# EAGLE board cosmicpifpgaOHL (EAGLE 8.3.1), part 1 of 2
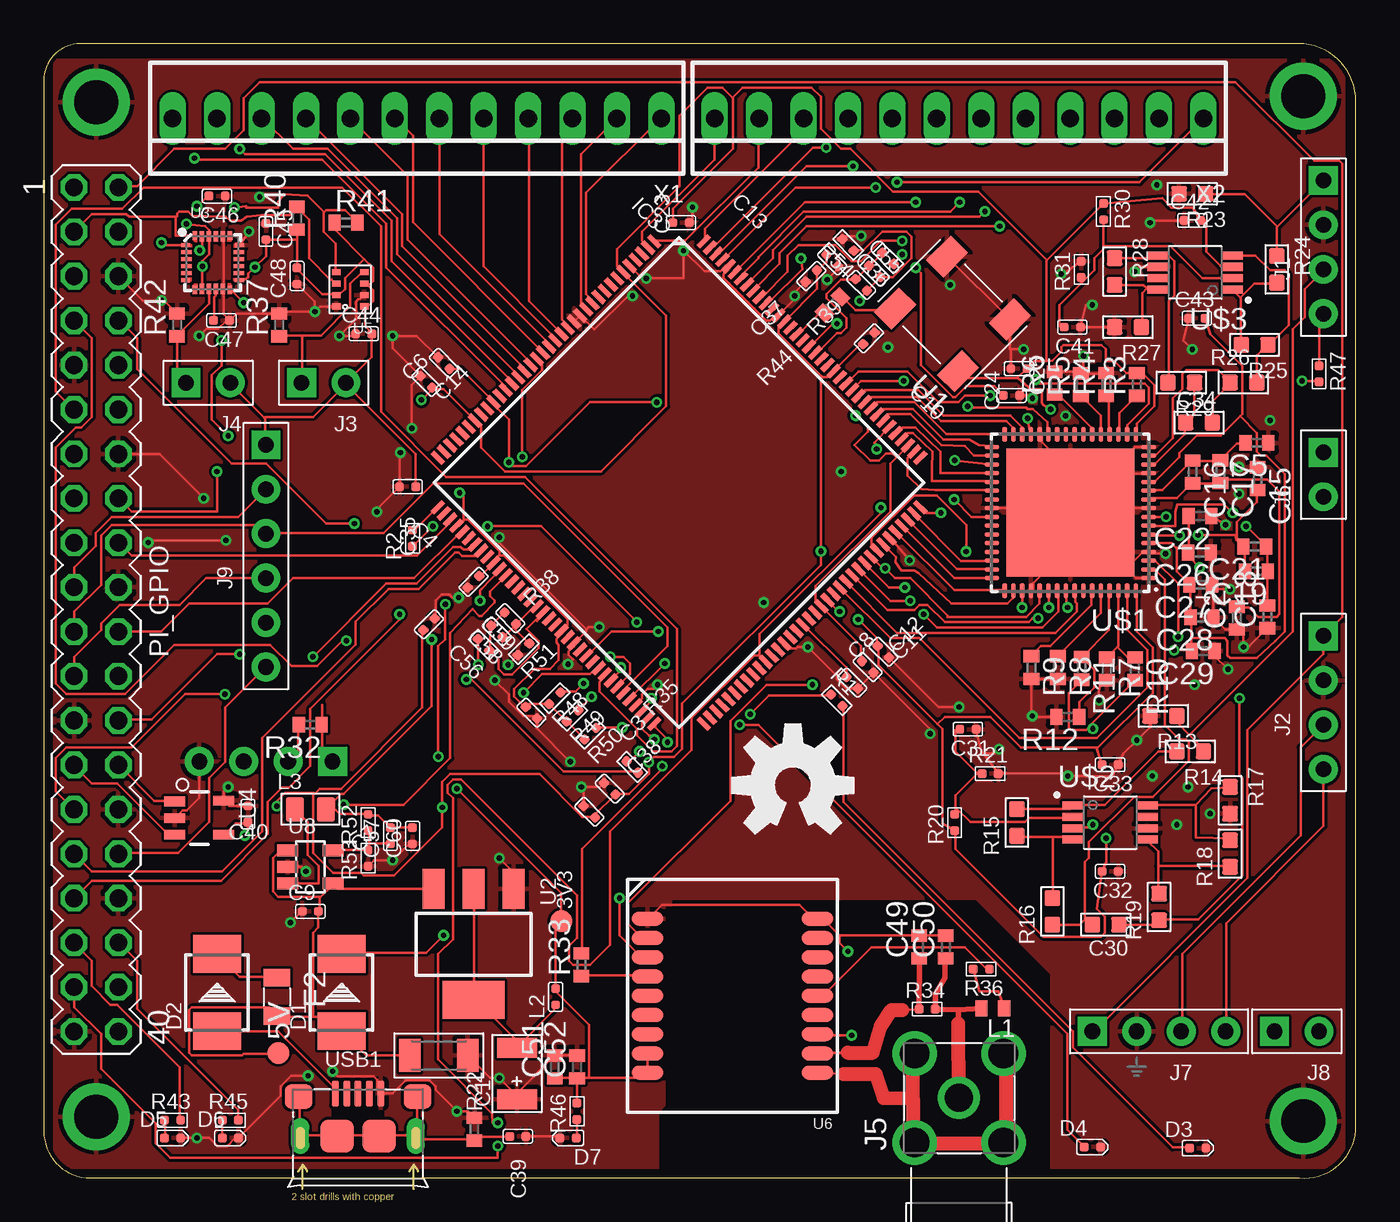
[diagram p2: board, top side]
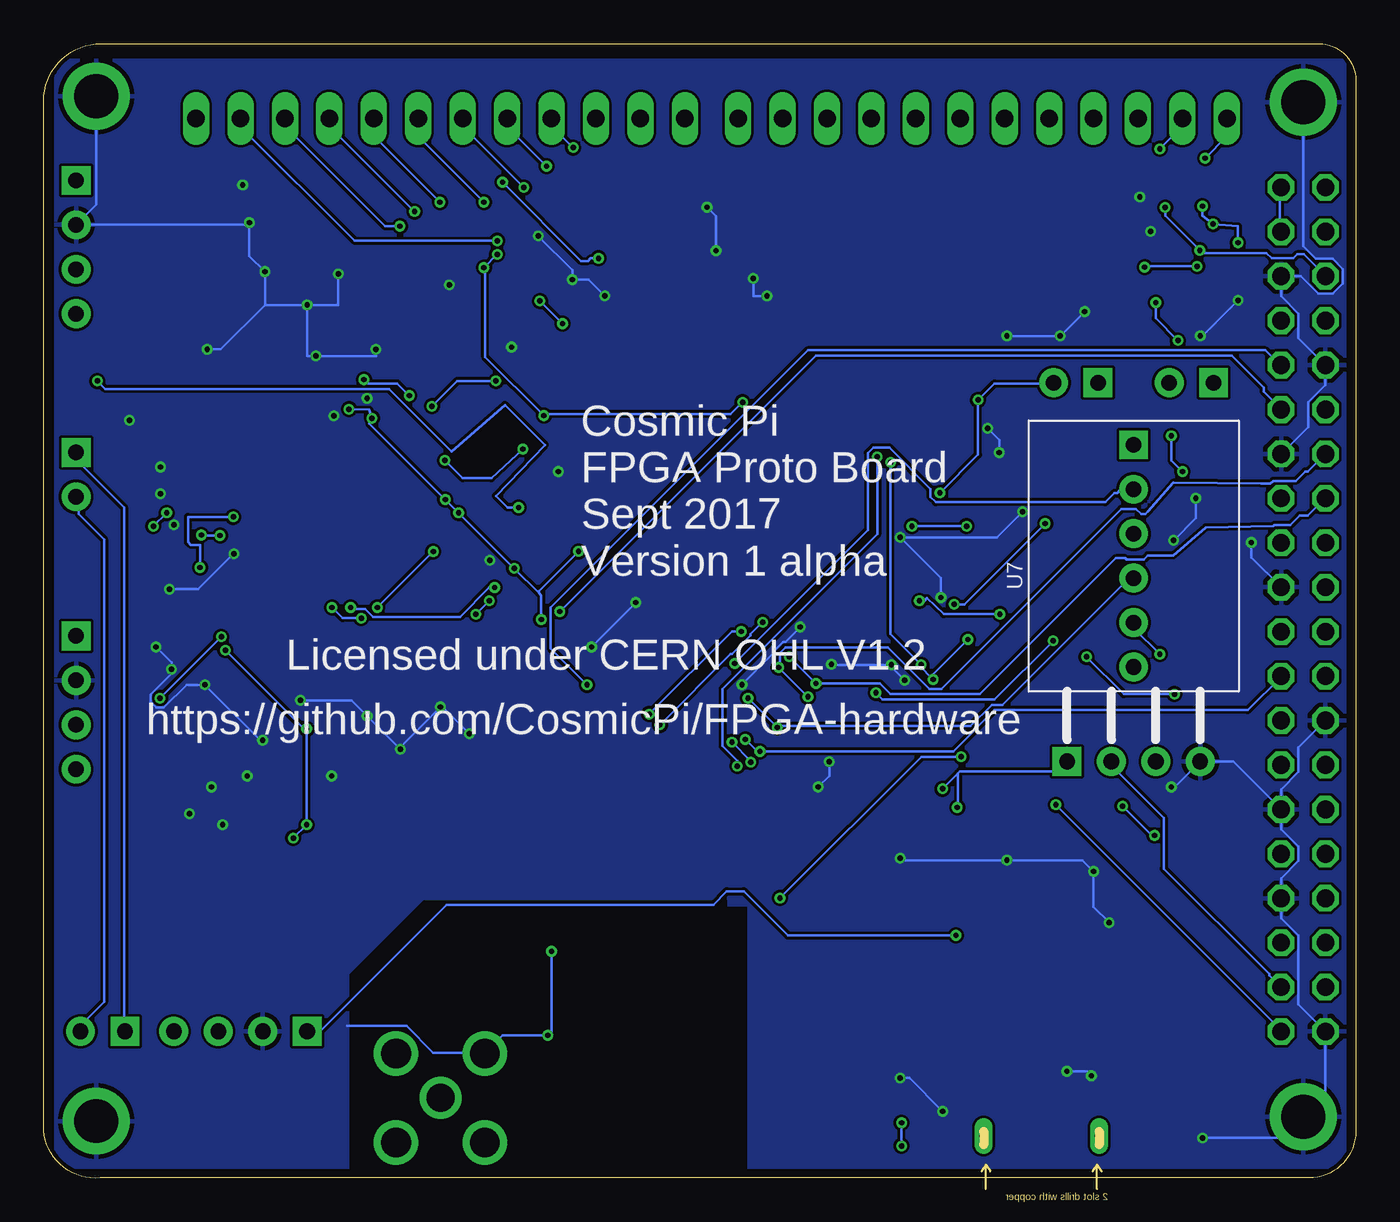
[diagram p3: board, bottom side, seen from below]

Size 75 x 64.85 mm. Coordinates in mm from the lower left corner, seen from the top.
Outline: 71.73,64.85 2.09,64.85 arc90 0,62.76 0,2.68 arc90 2.67,0.01 71.78,0.01 arc90 75,2.72 75,61.58 arc90 71.73,64.85
Copper layers (1*16): Top 0.035mm / dielectric 1.5mm / Bottom 0.035mm
Design rules "SeeedStudio_2layer_DRU_no_angle_20140221": minimum track width 6mil, minimum drill 12mil, track to track 6mil, track to pad 6mil, pad to pad 6mil, via to via 6mil, smd to smd 0mil, copper to edge 10mil, drill to drill 10mil, minimum pad ring 10mil, minimum via ring 6mil, stop-mask expansion 2mil, vias tented up to drill 100mil, thermal gap 10mil
Net classes: 0 default: width 0.152 mm, clearance 0.152 mm; 1 power: width 0.152 mm, clearance 0.152 mm; 2 thin_power: width 0.152 mm, clearance 0.152 mm; 3 timing: width 0.152 mm, drill 0.406 mm, clearance 0.152 mm to class 0, clearance 0.152 mm to class 1, clearance 0.152 mm to class 2, clearance 0.152 mm; 5 PSU: width 0.152 mm, drill 0.406 mm, clearance 0.152 mm to class 0, clearance 0.152 mm to class 1, clearance 0.152 mm to class 2, clearance 0.152 mm to class 3, clearance 0.152 mm to class 4, clearance 0.152 mm; 6 Vbias: width 0.152 mm, drill 0.406 mm, clearance 0.254 mm to class 0, clearance 0.254 mm to class 1, clearance 0.254 mm to class 2, clearance 0.254 mm to class 3, clearance 0.254 mm to class 4, clearance 0.254 mm to class 5, clearance 0.356 mm
tRestrict: area -3.3,64 to 76.2,68.6; area 74.4,-1.3 to 79.2,66.3; area -3.6,-3.5 to 77.7,0.5; area -3.3,-5.3 to 0.5,65; area 35.6,0.5 to 43.2,15.5
bRestrict: area -3.3,64 to 76.2,68.6; area 74.4,-1.3 to 79.2,66.3; area -3.6,-3.5 to 77.5,0.5; area -3.3,-5.3 to 0.5,66.8; area 34.8,0.5 to 43.9,15.5

## Footprints (pad centres in the part's own frame; a part is rotated, then mirrored left to right if it is on the bottom)
B1,27 = smd 1.27 x 1.27: TP 0,0
AVX-B = smd 1.143 x 2.286: + -1.46,0; - 1.46,0
C0402 = smd 0.7 x 0.9: 1 -0.65,0; 2 0.65,0
C0402' = smd 0.5 x 0.5: 1 0,0.463; 2 0,-0.463
1206 = smd 1.219 x 1.88: 1 -1.651,0; 2 1.651,0
C0603 = smd 0.889 x 0.889: 1 0,0.762; 2 0,-0.762
DO-214AA = smd 2.159 x 2.743: + -2.21,0; - 2.21,0
LED-0402 = smd 0.5 x 0.5: + -0.463,0; - 0.463,0
F0805 = smd 1 x 1.5: P$1 -1.1,0; P$2 1.1,0
TQFP144 = smd 0.9 x 0.3: 1 -10.75,8.75; 2 -10.75,8.25; 3 -10.75,7.75; 4 -10.75,7.25; 5 -10.75,6.75; 6 -10.75,6.25; 7 -10.75,5.75; 8 -10.75,5.25; 9 -10.75,4.75; 10 -10.75,4.25; 11 -10.75,3.75; 12 -10.75,3.25; 13 -10.75,2.75; 14 -10.75,2.25; 15 -10.75,1.75; 16 -10.75,1.25; 17 -10.75,0.75; 18 -10.75,0.25; 19 -10.75,-0.25; 20 -10.75,-0.75; 21 -10.75,-1.25; 22 -10.75,-1.75; 23 -10.75,-2.25; 24 -10.75,-2.75; 25 -10.75,-3.25; 26 -10.75,-3.75; 27 -10.75,-4.25; 28 -10.75,-4.75; 29 -10.75,-5.25; 30 -10.75,-5.75; 31 -10.75,-6.25; 32 -10.75,-6.75; 33 -10.75,-7.25; 34 -10.75,-7.75; 35 -10.75,-8.25; 36 -10.75,-8.75; 73 10.75,-8.75; 74 10.75,-8.25; 75 10.75,-7.75; 76 10.75,-7.25; 77 10.75,-6.75; 78 10.75,-6.25; 79 10.75,-5.75; 80 10.75,-5.25; 81 10.75,-4.75; 82 10.75,-4.25; 83 10.75,-3.75; 84 10.75,-3.25; 85 10.75,-2.75; 86 10.75,-2.25; 87 10.75,-1.75; 88 10.75,-1.25; 89 10.75,-0.75; 90 10.75,-0.25; 91 10.75,0.25; 92 10.75,0.75; 93 10.75,1.25; 94 10.75,1.75; 95 10.75,2.25; 96 10.75,2.75; 97 10.75,3.25; 98 10.75,3.75; 99 10.75,4.25; 100 10.75,4.75; 101 10.75,5.25; 102 10.75,5.75; 103 10.75,6.25; 104 10.75,6.75; 105 10.75,7.25; 106 10.75,7.75; 107 10.75,8.25; 108 10.75,8.75 | smd 0.3 x 0.9: 37 -8.75,-10.75; 38 -8.25,-10.75; 39 -7.75,-10.75; 40 -7.25,-10.75; 41 -6.75,-10.75; 42 -6.25,-10.75; 43 -5.75,-10.75; 44 -5.25,-10.75; 45 -4.75,-10.75; 46 -4.25,-10.75; 47 -3.75,-10.75; 48 -3.25,-10.75; 49 -2.75,-10.75; 50 -2.25,-10.75; 51 -1.75,-10.75; 52 -1.25,-10.75; 53 -0.75,-10.75; 54 -0.25,-10.75; 55 0.25,-10.75; 56 0.75,-10.75; 57 1.25,-10.75; 58 1.75,-10.75; 59 2.25,-10.75; 60 2.75,-10.75; 61 3.25,-10.75; 62 3.75,-10.75; 63 4.25,-10.75; 64 4.75,-10.75; 65 5.25,-10.75; 66 5.75,-10.75; 67 6.25,-10.75; 68 6.75,-10.75; 69 7.25,-10.75; 70 7.75,-10.75; 71 8.25,-10.75; 72 8.75,-10.75; 109 8.75,10.75; 110 8.25,10.75; 111 7.75,10.75; 112 7.25,10.75; 113 6.75,10.75; 114 6.25,10.75; 115 5.75,10.75; 116 5.25,10.75; 117 4.75,10.75; 118 4.25,10.75; 119 3.75,10.75; 120 3.25,10.75; 121 2.75,10.75; 122 2.25,10.75; 123 1.75,10.75; 124 1.25,10.75; 125 0.75,10.75; 126 0.25,10.75; 127 -0.25,10.75; 128 -0.75,10.75; 129 -1.25,10.75; 130 -1.75,10.75; 131 -2.25,10.75; 132 -2.75,10.75; 133 -3.25,10.75; 134 -3.75,10.75; 135 -4.25,10.75; 136 -4.75,10.75; 137 -5.25,10.75; 138 -5.75,10.75; 139 -6.25,10.75; 140 -6.75,10.75; 141 -7.25,10.75; 142 -7.75,10.75; 143 -8.25,10.75; 144 -8.75,10.75
H4-2.54 = drill 0.889 pad 1.651 square: 1 0,3.81 | drill 0.889 pad 1.651: 2 0,1.27; 3 0,-1.27; 4 0,-3.81
H2-2.54 = drill 0.889 pad 1.651 square: 1 0,1.27 | drill 0.889 pad 1.651: 2 0,-1.27
TE_5-1814400-1 = drill 1.7 pad 2.3: 1 -2.54,2.54; 2 -2.54,-2.54; 3 2.54,-2.54; 4 2.54,2.54 | drill 1.6 pad 2.2: 5 0,0
H6-2.54 = drill 0.889 pad 1.651 square: 1 0,6.35 | drill 0.889 pad 1.651: 2 0,3.81; 3 0,1.27; 4 0,-1.27; 5 0,-3.81; 6 0,-6.35
L0402 = smd 0.7 x 0.9: P$1 -0.65,0; P$2 0.65,0
L0402' = smd 0.5 x 0.5: 1 -0.463,0; 2 0.463,0
L0805 = smd 1.016 x 1.397: 1 -0.889,0; 2 0.889,0
MA20-2 = drill 1.016 octagon: 1 -24.13,-1.27; 2 -24.13,1.27; 3 -21.59,-1.27; 4 -21.59,1.27; 5 -19.05,-1.27; 6 -19.05,1.27; 7 -16.51,-1.27; 8 -16.51,1.27; 9 -13.97,-1.27; 10 -13.97,1.27; 11 -11.43,-1.27; 12 -11.43,1.27; 13 -8.89,-1.27; 14 -8.89,1.27; 15 -6.35,-1.27; 16 -6.35,1.27; 17 -3.81,-1.27; 18 -3.81,1.27; 19 -1.27,-1.27; 20 -1.27,1.27; 21 1.27,-1.27; 22 1.27,1.27; 23 3.81,-1.27; 24 3.81,1.27; 25 6.35,-1.27; 26 6.35,1.27; 27 8.89,-1.27; 28 8.89,1.27; 29 11.43,-1.27; 30 11.43,1.27; 31 13.97,-1.27; 32 13.97,1.27; 33 16.51,-1.27; 34 16.51,1.27; 35 19.05,-1.27; 36 19.05,1.27; 37 21.59,-1.27; 38 21.59,1.27; 39 24.13,-1.27; 40 24.13,1.27
R0402 = smd 0.5 x 0.5: 1 0,0.463; 2 0,-0.463
R0402' = smd 0.7 x 0.9: 1 -0.65,0; 2 0.65,0
R0603 = smd 0.889 x 0.889: 1 0,0.762; 2 0,-0.762
X7050_4P = smd 1.4 x 2: P$1 -2.54,-2.1; P$2 2.54,-2.1; P$3 2.54,2.1; P$4 -2.54,2.1
SOT-223 = smd 1.27 x 2.286: 1 -2.286,-3.175; 2 0,-3.175; 3 2.286,-3.175 | smd 3.556 x 2.159: TER 0,3.175
MPU-9250 = smd 0.495 x 0.25: 1 -1.552,1; 6 -1.552,-1; 13 1.552,-1; 18 1.552,1 | smd 0.6 x 0.25: 2 -1.5,0.6; 3 -1.5,0.2; 4 -1.5,-0.2; 5 -1.5,-0.6; 14 1.5,-0.6; 15 1.5,-0.2; 16 1.5,0.2; 17 1.5,0.6 | smd 0.25 x 0.495: 7 -1,-1.552; 12 1,-1.552; 19 1,1.552; 24 -1,1.552 | smd 0.25 x 0.6: 8 -0.6,-1.5; 9 -0.2,-1.5; 10 0.2,-1.5; 11 0.6,-1.5; 20 0.6,1.5; 21 0.2,1.5; 22 -0.2,1.5; 23 -0.6,1.5
SOT235 = smd 0.55 x 1.2: 1 -0.95,-1.4; 2 0,-1.4; 3 0.95,-1.4; 4 0.95,1.4; 5 -1,1.4
BMP280 = smd 0.5 x 0.35: 1 0.8,0.975; 2 0.8,0.325; 3 0.8,-0.325; 4 0.8,-0.975; 5 -0.8,-0.975; 6 -0.8,-0.325; 7 -0.8,0.325; 8 -0.8,0.975
L70-M39 = smd 1.8 x 0.8: 1 4.85,-4.4; 2 4.85,-3.3; 3 4.85,-2.2; 4 4.85,-1.1; 5 4.85,0; 6 4.85,1.1; 7 4.85,2.2; 8 4.85,3.3; 9 4.85,4.4; 10 -4.85,4.4; 11 -4.85,3.3; 12 -4.85,2.2; 13 -4.85,1.1; 14 -4.85,0; 15 -4.85,-1.1; 16 -4.85,-2.2; 17 -4.85,-3.3; 18 -4.85,-4.4
SNR4-2.54-15.5X12.0X5.5MM = drill 0.889 pad 1.651 square: 1 -11.75,3.81 | drill 0.889 pad 1.651: 2 -11.75,1.27; 3 -11.75,-1.27; 4 -11.75,-3.81
SOT-23-5 = smd 0.69 x 1.2: 1 -0.95,-1.3; 2 0,-1.3; 3 0.95,-1.3; 4 0.95,1.3; 5 -0.95,1.3
QFN50P900X900X100-65N = smd 0.85 x 0.28: 1 -4.475,3.75; 2 -4.475,3.25; 3 -4.475,2.75; 4 -4.475,2.25; 5 -4.475,1.75; 6 -4.475,1.25; 7 -4.475,0.75; 8 -4.475,0.25; 9 -4.475,-0.25; 10 -4.475,-0.75; 11 -4.475,-1.25; 12 -4.475,-1.75; 13 -4.475,-2.25; 14 -4.475,-2.75; 15 -4.475,-3.25; 16 -4.475,-3.75; 33 4.475,-3.75; 34 4.475,-3.25; 35 4.475,-2.75; 36 4.475,-2.25; 37 4.475,-1.75; 38 4.475,-1.25; 39 4.475,-0.75; 40 4.475,-0.25; 41 4.475,0.25; 42 4.475,0.75; 43 4.475,1.25; 44 4.475,1.75; 45 4.475,2.25; 46 4.475,2.75; 47 4.475,3.25; 48 4.475,3.75 | smd 0.28 x 0.85: 17 -3.75,-4.475; 18 -3.25,-4.475; 19 -2.75,-4.475; 20 -2.25,-4.475; 21 -1.75,-4.475; 22 -1.25,-4.475; 23 -0.75,-4.475; 24 -0.25,-4.475; 25 0.25,-4.475; 26 0.75,-4.475; 27 1.25,-4.475; 28 1.75,-4.475; 29 2.25,-4.475; 30 2.75,-4.475; 31 3.25,-4.475; 32 3.75,-4.475; 49 3.75,4.475; 50 3.25,4.475; 51 2.75,4.475; 52 2.25,4.475; 53 1.75,4.475; 54 1.25,4.475; 55 0.75,4.475; 56 0.25,4.475; 57 -0.25,4.475; 58 -0.75,4.475; 59 -1.25,4.475; 60 -1.75,4.475; 61 -2.25,4.475; 62 -2.75,4.475; 63 -3.25,4.475; 64 -3.75,4.475 | smd 7.3 x 7.3: 65 0,0
SOP65P490X110-8N = smd 1.25 x 0.46: 1 -2.11,0.975; 2 -2.11,0.325; 3 -2.11,-0.325; 4 -2.11,-0.975; 5 2.11,-0.975; 6 2.11,-0.325; 7 2.11,0.325; 8 2.11,0.975
2.5MM-HOLE = drill 2.5 pad 3.81: P$1 0,0
MICRO-USB5+6P-SMD-0.65-B = smd 0.4 x 1.5: 1 -1.3,-0.25; 2 -0.65,-0.25; 3 0,-0.25; 4 0.65,-0.25; 5 1.3,-0.25 | smd 1.6 x 1.4: S1 -3.4,-0.427; S6 3.4,-0.427 | drill 0.508 pad 1.016 long: S2 -3.3,-2.675; S5 3.3,-2.675 | smd 1.9 x 1.9: S3 -1.2,-2.675; S4 1.2,-2.675
22-23-2121 = drill 1 long: 1 -13.97,0; 2 -11.43,0; 3 -8.89,0; 4 -6.35,0; 5 -3.81,0; 6 -1.27,0; 7 1.27,0; 8 3.81,0; 9 6.35,0; 10 8.89,0; 11 11.43,0; 12 13.97,0

## Placement (x,y rotation side)
3V3  TPB1,27  [B1,27]  29.58,14.69 90 top
5V  TPB1,27  [B1,27]  13.4,7.16 90 top
C1  22uf  [AVX-B]  27.05,5.98 90 top
C2  0.1u  [C0402]  68.2,32.02 90 top
C3  1UF 6.3V  [C0402']  32.36,22.27 225 top
C4  1UF 6.3V  [C0402']  24.57,34.09 315 top
C5  0.1u  [C0402]  69.34,42.04 180 top
C6  1UF 6.3V  [C0402']  21.87,45.52 45 top
C7  1UF 6.3V  [C0402']  27.88,26.61 45 top
C8  1UF 6.3V  [C0402']  48,30.09 45 top
C9  10uf  [C0402']  15.24,15.25 90 top
C10  1UF 6.3V  [C0402']  47.17,48.01 315 top
C11  1UF 6.3V  [C0402']  46.21,28.33 45 top
C12  1UF 6.3V  [C0402']  47.1,29.22 45 top
C13  1UF 6.3V  [C0402']  43.88,51.57 315 top
C14  1UF 6.3V  [C0402']  22.87,46.6 225 top
C15  0.1u  [C0402]  69.39,39.99 270 top
C16  .1u  [C0402]  65.67,40.38 270 top
C17  10u  [C0402]  67.25,40.38 270 top
C18  0.1u  [C0402]  69.95,32.09 90 top
C19  0.1u  [C0402]  69.31,34.69 180 top
C20  47uF  [1206]  22.58,7.01 0 top
C21  10u  [C0402]  69.22,36.1 180 top
C22  0.1u  [C0402]  66.1,37.84 180 top
C23  1UF 6.3V  [C0402']  36.43,54.62 90 top
C24  1UF 6.3V  [C0402']  55.32,44.74 270 top
C25  1UF 6.3V  [C0402']  55.75,46.28 90 top
C26  10u  [C0402]  66.07,35.77 180 top
C27  0.1u  [C0402]  66.13,33.93 180 top
C28  0.1u  [C0402]  66.21,32.06 180 top
C29  0.1u  [C0402]  66.28,30.13 180 top
C30  DNP  [C0603]  60.71,14.49 270 top
C31  100nf  [C0402']  52.83,25.66 270 top
C32  10uf  [C0402']  60.96,17.54 270 top
C33  100nf  [C0402']  60.96,23.63 270 top
C34  DNP  [C0603]  66.04,43.19 90 top
C35  1UF 6.3V  [C0402']  20.8,39.53 270 top
C36  10uf  [C0402']  46.74,51.06 45 top
C37  10pf  [C0402']  45.07,52.46 45 top
C38  10nf  [C0402']  31.19,20.94 225 top
C39  10uf  [C0402']  27.1,2.39 270 top
C40  10uf  [C0402']  11.68,20.82 180 top
C41  100nf  [C0402']  58.8,48.65 270 top
C42  10uf  [C0402']  65.66,54.75 90 top
C43  100nf  [C0402']  65.91,49.16 90 top
C44  100nf  [C0402']  18.29,48.27 90 top
C45  10nf  [C0402']  12.7,54.11 0 top
C46  100nf  [C0402']  9.91,56.14 270 top
C47  100nf  [C0402']  10.16,49.03 270 top
C48  100nf  [C0402']  14.48,51.57 180 top
C49  DNP  [C0402]  50.04,13.22 90 top
C50  DNP  [C0402]  51.56,13.22 90 top
C51  10u  [C0402]  29.21,6.36 90 top
C52  100n  [C0402]  30.48,6.36 90 top
C55  100nf  [C0402']  47.5,51.83 45 top
C56  10uf  [C0402']  22.02,31.66 135 top
C57  22pf  [C0402']  19.81,19.57 180 top
C58  10uf  [C0402']  25.91,31.25 225 top
C59  100nf  [C0402']  26.67,32.01 225 top
C60  10uf  [C0402']  21.08,19.57 180 top
D1  28V-5A  [DO-214AA]  17.02,10.62 90 top
D2  28V-5A  [DO-214AA]  9.91,10.62 90 top
D3  BLUE-0402  [LED-0402]  65.97,1.71 0 top
D4  BLUE-0402  [LED-0402]  59.94,1.79 0 top
D5  BLUE-0402  [LED-0402]  7.37,2.3 0 top
D6  BLUE-0402  [LED-0402]  10.67,2.3 0 top
D7  BLUE-0402  [LED-0402]  29.97,2.3 180 top
F2  307010159_SMD_PPTC_6V_0805  [F0805]  13.34,10.36 270 top
IC3  ICE40HX4K_TQFP144  [TQFP144]  36.32,39.77 315 top
J1  4p-2.54  [H4-2.54]  73.15,53.22 0 top
J2  4p-2.54  [H4-2.54]  73.15,27.19 0 top
J3  [H2-2.54]  16,45.48 90 top
J4  [H2-2.54]  9.4,45.48 90 top
J5  5-1814400-1  [TE_5-1814400-1]  52.32,4.58 0 top
J6  2p-2.54  [H2-2.54]  73.15,40.22 0 top
J7  4p-2.54  [H4-2.54]  63.75,8.39 90 top
J8  2p-2.54  [H2-2.54]  71.63,8.39 90 top
J9  6p-2.54  [H6-2.54]  12.7,35.57 0 top
L1  303010107_47NH_0402  [L0402]  54.25,9.71 180 top
L2  4.7NH-300MA  [L0402']  29.26,10.37 90 top
L3  2.2UH-1.2A  [L0805]  15.24,21.09 0 top
OSHW  OSHW-LOGOL  [OSHW-LOGO-L]  42.82,22.46 0 top
PI_GPIO  [MA20-2]  3,32.51 270 top
R1  100R  [R0402]  45.33,27.32 45 top
R2  100R  [R0402]  21.08,36.59 180 top
R3  10k  [R0402']  62.48,45.38 90 top
R4  10k  [R0402']  60.73,45.37 90 top
R5  10k  [R0402']  59.29,45.36 90 top
R6  10k  [R0402']  57.79,45.45 90 top
R7  DNP  [R0402']  60.78,29.11 270 top
R8  10k  [R0402']  57.98,29.19 270 top
R9  10k  [R0402']  56.46,29.19 270 top
R10  10k  [R0402']  62.38,29.11 270 top
R11  10k  [R0402']  59.33,29.14 270 top
R12  DNP  [R0402']  58.53,26.36 180 top
R13  49.9R  [R0603]  64.01,26.43 90 top
R14  470R  [R0603]  65.53,24.39 90 top
R15  470R  [R0603]  55.63,20.33 0 top
R16  49.9R  [R0603]  57.66,15.25 0 top
R17  510R  [R0603]  67.82,21.6 180 top
R18  470R  [R0603]  67.82,18.55 0 top
R19  49.9R  [R0603]  63.75,15.5 0 top
R20  10K 1/16W  [R0402]  52.07,20.33 180 top
R21  10K 1/16W  [R0402]  54.1,23.12 90 top
R22  1M  [R0402']  24.62,2.8 90 top
R23  49.9R  [R0603]  65.66,56.27 90 top
R24  470R  [R0603]  70.48,51.95 180 top
R25  470R  [R0603]  69.22,47.64 90 top
R26  49.9R  [R0603]  68.58,45.48 270 top
R27  510R  [R0603]  61.98,48.65 90 top
R28  470R  [R0603]  61.21,51.83 180 top
R29  49.9R  [R0603]  65.02,45.48 90 top
R30  10K 1/16W  [R0402]  60.58,55.26 0 top
R31  10K 1/16W  [R0402]  59.31,51.95 180 top
R32  4k7  [R0402']  15.24,25.92 180 top
R33  10  [R0402']  30.73,12.2 90 top
R34  0R  [R0402]  50.5,9.66 90 top
R35  10K 1/16W  [R0402]  33.64,23.51 225 top
R36  10R 1/16W  [R0402]  53.59,11.95 270 top
R37  10k  [R0402']  13.46,48.78 90 top
R38  100R  [R0402]  25.14,30.49 225 top
R39  100R  [R0402]  48.26,52.59 225 top
R40  4k7  [R0402']  14.48,54.87 90 top
R41  4k7  [R0402']  17.27,54.62 0 top
R42  10k  [R0402']  7.62,48.78 90 top
R43  100R  [R0402]  7.37,3.31 90 top
R44  22R  [R0402']  45.09,49.92 225 top
R45  100R  [R0402]  10.67,3.31 90 top
R46  100R  [R0402]  30.48,3.82 180 top
R47  100R  [R0402]  72.9,45.98 0 top
R48  10K 1/16W  [R0402]  29.21,27.44 315 top
R49  10K 1/16W  [R0402]  30.23,26.43 315 top
R50  10K 1/16W  [R0402]  31.24,25.41 315 top
R51  DNP  [R0402]  27.43,30.24 315 top
R52  100K  [R0402]  18.54,20.33 180 top
R53  100K  [R0402]  18.54,18.3 180 top
R54  DNP  [R0402]  45.97,53.35 225 top
U1  306020003_OSC_50MHZ-7050_4P  [X7050_4P]  51.95,49.41 135 top
U2  CJT1117-3.3-SOT223  [SOT-223]  24.58,13.36 180 top
U3  [MPU-9250]  9.65,52.33 0 top
U4  310090051_24LC32AT-I/OT  [SOT235]  8.89,20.58 270 top
U5  [BMP280]  17.53,50.81 180 top
U6  [L70-M39]  39.37,10.42 180 top
U7  DHT11  [SNR4-2.54-15.5X12.0X5.5MM]  12.7,35.57 90 bottom
U8  ETA3406S2F-T-SOT23-5  [SOT-23-5]  15.24,17.79 270 top
U$1  AD9216BCPZ-105  [QFN50P900X900X100-65N]  58.68,38.05 180 top
U$2  AD8138  [SOP65P490X110-8N]  60.96,20.33 0 top
U$3  AD8138  [SOP65P490X110-8N]  65.81,51.77 180 top
U$16  HOLE-2.5MM  [2.5MM-HOLE]  3,3.51 0 top
U$21  HOLE-2.5MM  [2.5MM-HOLE]  3,61.51 0 top
U$22  HOLE-2.5MM  [2.5MM-HOLE]  72,61.85 0 top
U$24  HOLE-2.5MM  [2.5MM-HOLE]  72,3.26 0 top
USB1  10118193-0001LF  [MICRO-USB5+6P-SMD-0.65-B]  17.97,5.09 0 top
X1  22-23-2121  [22-23-2121]  21.34,60.59 180 top
X2  22-23-2121  [22-23-2121]  52.32,60.59 180 top